# Altium project MCORD_Hub.PrjPcb (part 4 of 4)
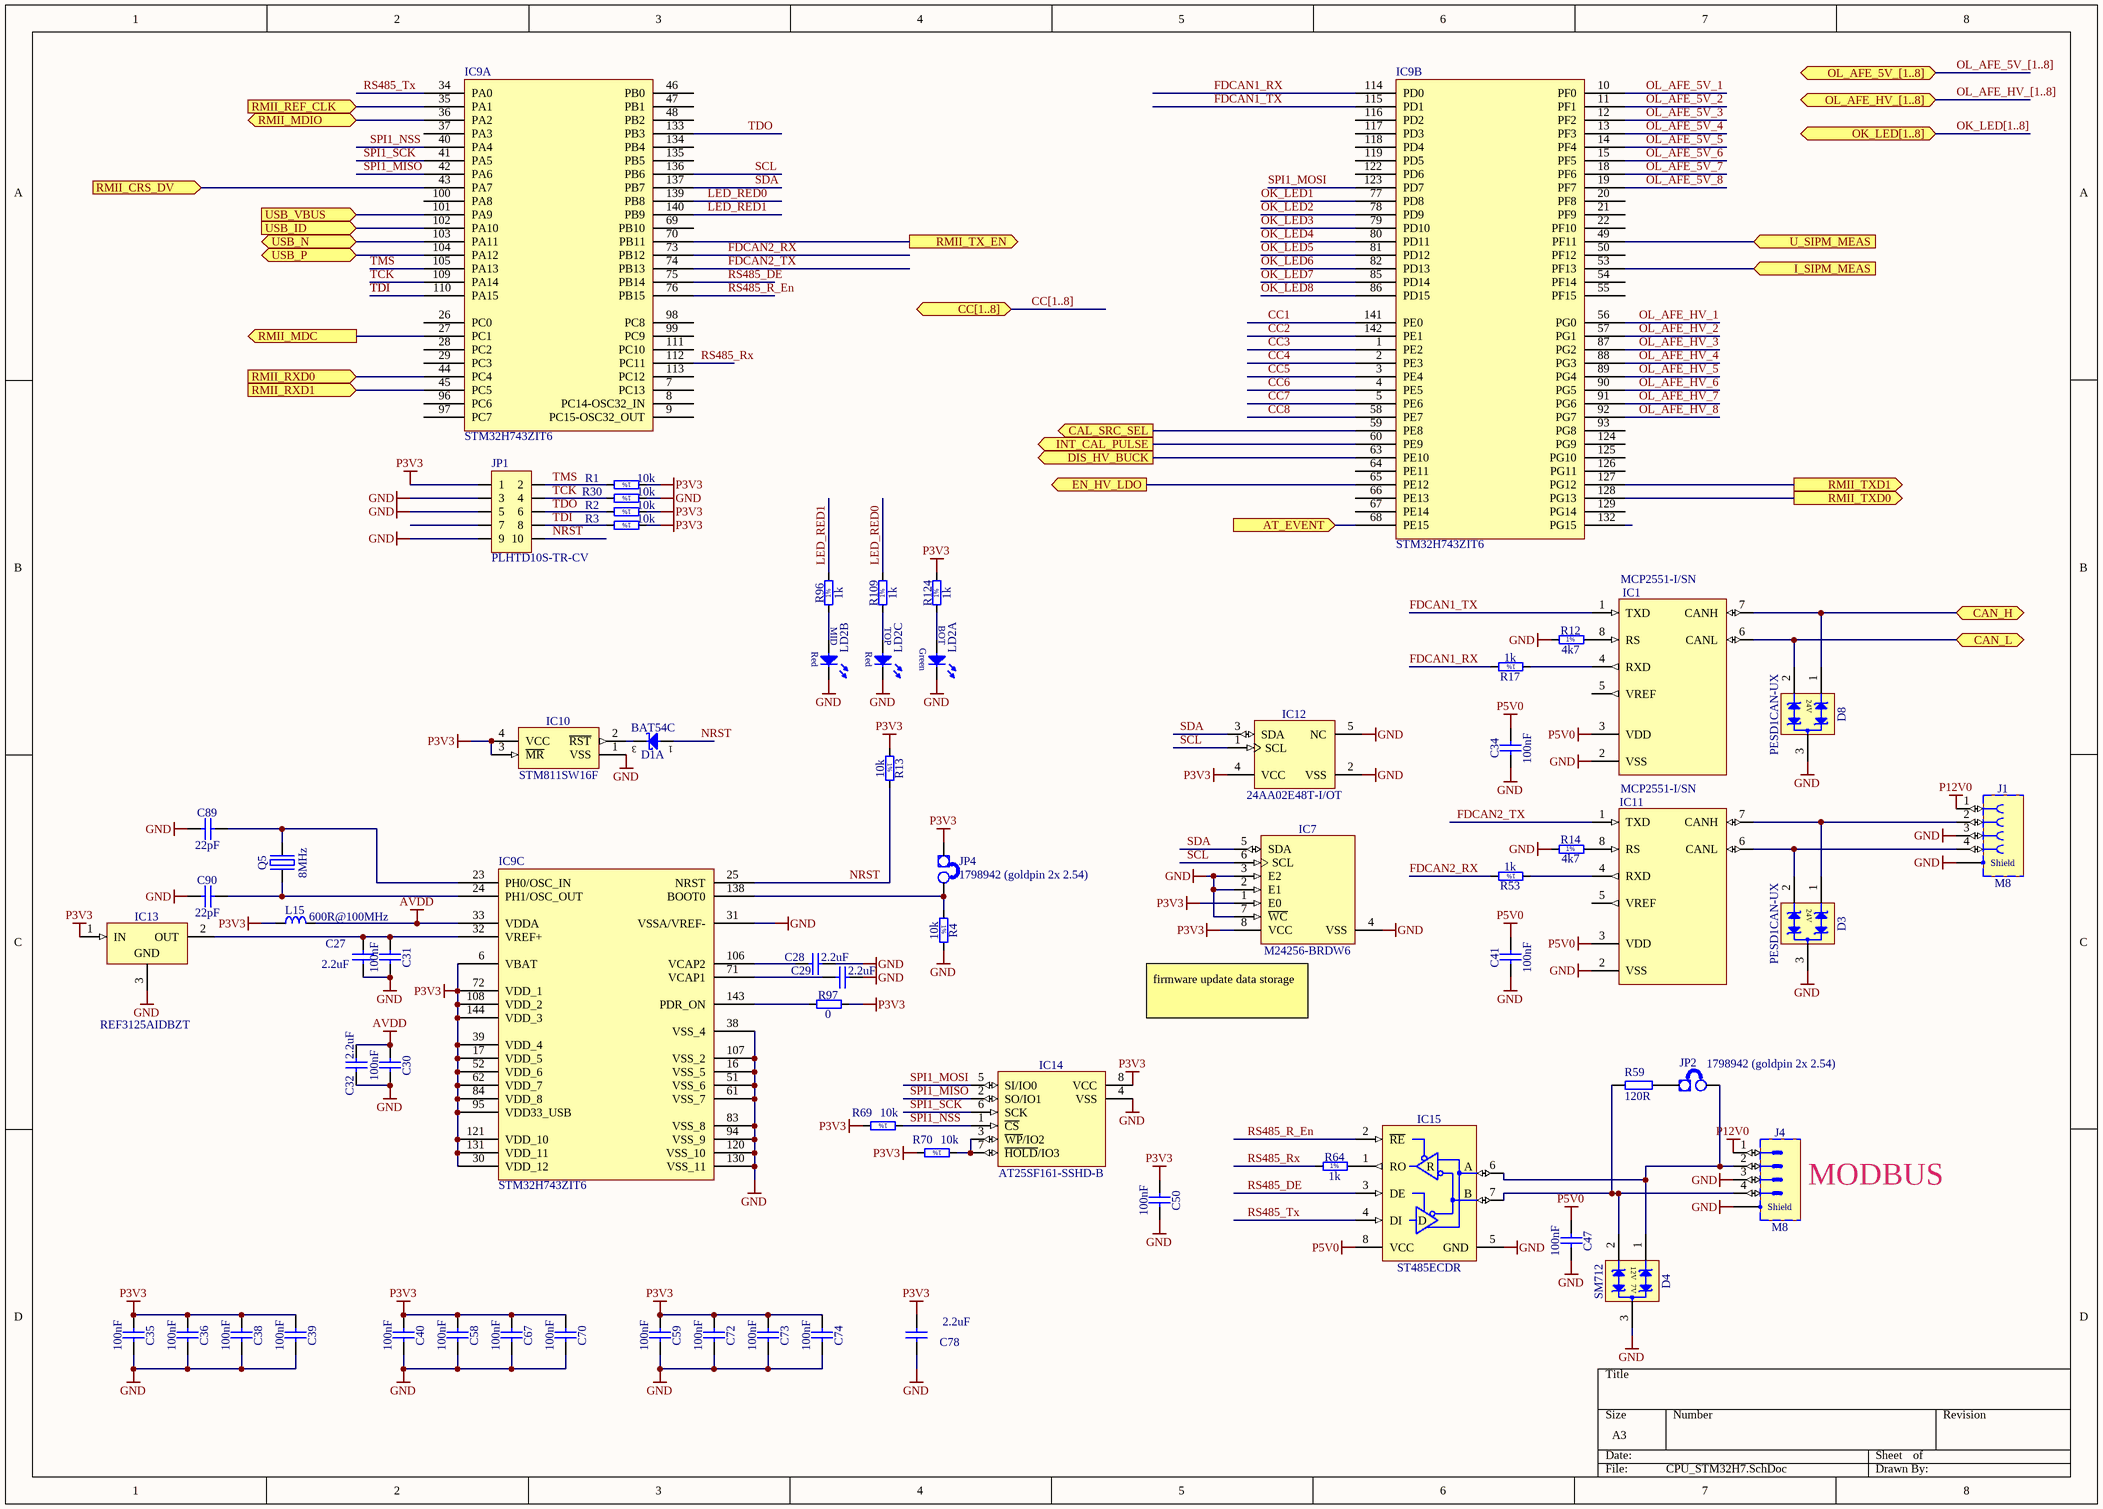
[diagram p7: CPU_STM32H7.SchDoc]

## Nets that join several sheets
GND: MCORD_Hub (53 pins), U_SIPM_ASSY_CON1 (13 pins), U_SIPM_ASSY_CON2 (13 pins), U_SIPM_ASSY_CON3 (13 pins), U_SIPM_ASSY_CON4 (13 pins), U_SIPM_ASSY_CON5 (13 pins), U_SIPM_ASSY_CON6 (13 pins), U_SIPM_ASSY_CON7 (13 pins), U_SIPM_ASSY_CON8 (13 pins), Boost_CNV (28 pins), RMII_Ethernet (21 pins), USB (6 pins), PoE (23 pins), CPU_STM32H7 (64 pins)
P3V3: MCORD_Hub (11 pins), U_SIPM_ASSY_CON1 (R78A.1), U_SIPM_ASSY_CON2 (R78B.1), U_SIPM_ASSY_CON3 (R78C.1), U_SIPM_ASSY_CON4 (R78D.1), U_SIPM_ASSY_CON5 (R78E.1), U_SIPM_ASSY_CON6 (R78F.1), U_SIPM_ASSY_CON7 (R78G.1), U_SIPM_ASSY_CON8 (R78H.1), RMII_Ethernet (8 pins), PoE (6 pins), CPU_STM32H7 (45 pins)
P5V0: U_SIPM_ASSY_CON1 (F2A.1 T1A.2), U_SIPM_ASSY_CON2 (F2B.1 T1B.2), U_SIPM_ASSY_CON3 (F2C.1 T1C.2), U_SIPM_ASSY_CON4 (F2D.1 T1D.2), U_SIPM_ASSY_CON5 (F2E.1 T1E.2), U_SIPM_ASSY_CON6 (F2F.1 T1F.2), U_SIPM_ASSY_CON7 (F2G.1 T1G.2), U_SIPM_ASSY_CON8 (F2H.1 T1H.2), PoE (9 pins), CPU_STM32H7 (6 pins)
P12V0: Boost_CNV (C117.2 IC18.10 L2.1 R6.2), PoE (7 pins), CPU_STM32H7 (J1.1 J4.1)
P70V0: U_SIPM_ASSY_CON1 (R80A.1 T2A.2), U_SIPM_ASSY_CON2 (R80B.1 T2B.2), U_SIPM_ASSY_CON3 (R80C.1 T2C.2), U_SIPM_ASSY_CON4 (R80D.1 T2D.2), U_SIPM_ASSY_CON5 (R80E.1 T2E.2), U_SIPM_ASSY_CON6 (R80F.1 T2F.2), U_SIPM_ASSY_CON7 (R80G.1 T2G.2), U_SIPM_ASSY_CON8 (R80H.1 T2H.2), Boost_CNV (R5.1 U2.4)
CAL0_N: MCORD_Hub (IC16.21 R35.1), U_SIPM_ASSY_CON4 (J12D.A10)
CAL0_N: MCORD_Hub (IC16.23 R32.1), U_SIPM_ASSY_CON3 (J12C.A10)
CAL0_N: MCORD_Hub (IC16.27 R61.1), U_SIPM_ASSY_CON2 (J12B.A10)
CAL0_N: MCORD_Hub (IC16.29 R60.1), U_SIPM_ASSY_CON1 (J12A.A10)
CAL0_N: MCORD_Hub (IC16.19 R37.1), U_SIPM_ASSY_CON5 (J12E.A10)
CAL0_N: MCORD_Hub (IC16.17 R39.1), U_SIPM_ASSY_CON6 (J12F.A10)
CAL0_N: MCORD_Hub (IC16.13 R41.1), U_SIPM_ASSY_CON7 (J12G.A10)
CAL0_N: MCORD_Hub (IC16.11 R43.1), U_SIPM_ASSY_CON8 (J12H.A10)
CAL0_P: MCORD_Hub (IC16.22 R33.1), U_SIPM_ASSY_CON4 (J12D.A11)
CAL0_P: MCORD_Hub (IC16.24 R65.1), U_SIPM_ASSY_CON3 (J12C.A11)
CAL0_P: MCORD_Hub (IC16.28 R25.1), U_SIPM_ASSY_CON2 (J12B.A11)
CAL0_P: MCORD_Hub (IC16.30 R55.1), U_SIPM_ASSY_CON1 (J12A.A11)
CAL0_P: MCORD_Hub (IC16.20 R36.1), U_SIPM_ASSY_CON5 (J12E.A11)
CAL0_P: MCORD_Hub (IC16.18 R38.1), U_SIPM_ASSY_CON6 (J12F.A11)
CAL0_P: MCORD_Hub (IC16.14 R40.1), U_SIPM_ASSY_CON7 (J12G.A11)
CAL0_P: MCORD_Hub (IC16.12 R42.1), U_SIPM_ASSY_CON8 (J12H.A11)
CAN_H: U_SIPM_ASSY_CON1 (J12A.B11), U_SIPM_ASSY_CON2 (J12B.B11), U_SIPM_ASSY_CON3 (J12C.B11), U_SIPM_ASSY_CON4 (J12D.B11), U_SIPM_ASSY_CON5 (J12E.B11), U_SIPM_ASSY_CON6 (J12F.B11), U_SIPM_ASSY_CON7 (J12G.B11), U_SIPM_ASSY_CON8 (J12H.B11)
CAN_L: U_SIPM_ASSY_CON1 (J12A.B10), U_SIPM_ASSY_CON2 (J12B.B10), U_SIPM_ASSY_CON3 (J12C.B10), U_SIPM_ASSY_CON4 (J12D.B10), U_SIPM_ASSY_CON5 (J12E.B10), U_SIPM_ASSY_CON6 (J12F.B10), U_SIPM_ASSY_CON7 (J12G.B10), U_SIPM_ASSY_CON8 (J12H.B10)
DET_OUT0_N: MCORD_Hub (J6.B3), U_SIPM_ASSY_CON1 (J12A.A3)
DET_OUT0_N: MCORD_Hub (J6.B6), U_SIPM_ASSY_CON2 (J12B.A3)
DET_OUT0_N: MCORD_Hub (J6.B9), U_SIPM_ASSY_CON3 (J12C.A3)
DET_OUT0_N: MCORD_Hub (J6.B12), U_SIPM_ASSY_CON4 (J12D.A3)
DET_OUT0_N: MCORD_Hub (J7.B3), U_SIPM_ASSY_CON5 (J12E.A3)
DET_OUT0_N: MCORD_Hub (J7.B6), U_SIPM_ASSY_CON6 (J12F.A3)
DET_OUT0_N: MCORD_Hub (J7.B9), U_SIPM_ASSY_CON7 (J12G.A3)
DET_OUT0_N: MCORD_Hub (J7.B12), U_SIPM_ASSY_CON8 (J12H.A3)
DET_OUT0_P: MCORD_Hub (J6.B2), U_SIPM_ASSY_CON1 (J12A.A2)
DET_OUT0_P: MCORD_Hub (J6.B5), U_SIPM_ASSY_CON2 (J12B.A2)
DET_OUT0_P: MCORD_Hub (J6.B8), U_SIPM_ASSY_CON3 (J12C.A2)
DET_OUT0_P: MCORD_Hub (J6.B11), U_SIPM_ASSY_CON4 (J12D.A2)
DET_OUT0_P: MCORD_Hub (J7.B2), U_SIPM_ASSY_CON5 (J12E.A2)
DET_OUT0_P: MCORD_Hub (J7.B5), U_SIPM_ASSY_CON6 (J12F.A2)
DET_OUT0_P: MCORD_Hub (J7.B8), U_SIPM_ASSY_CON7 (J12G.A2)
DET_OUT0_P: MCORD_Hub (J7.B11), U_SIPM_ASSY_CON8 (J12H.A2)
DET_OUT1_N: MCORD_Hub (J6.A3), U_SIPM_ASSY_CON1 (J12A.B3)
DET_OUT1_N: MCORD_Hub (J6.A6), U_SIPM_ASSY_CON2 (J12B.B3)
DET_OUT1_N: MCORD_Hub (J6.A9), U_SIPM_ASSY_CON3 (J12C.B3)
DET_OUT1_N: MCORD_Hub (J6.A12), U_SIPM_ASSY_CON4 (J12D.B3)
DET_OUT1_N: MCORD_Hub (J7.A3), U_SIPM_ASSY_CON5 (J12E.B3)
DET_OUT1_N: MCORD_Hub (J7.A6), U_SIPM_ASSY_CON6 (J12F.B3)
DET_OUT1_N: MCORD_Hub (J7.A9), U_SIPM_ASSY_CON7 (J12G.B3)
DET_OUT1_N: MCORD_Hub (J7.A12), U_SIPM_ASSY_CON8 (J12H.B3)
DET_OUT1_P: MCORD_Hub (J6.A2), U_SIPM_ASSY_CON1 (J12A.B2)
DET_OUT1_P: MCORD_Hub (J6.A5), U_SIPM_ASSY_CON2 (J12B.B2)
DET_OUT1_P: MCORD_Hub (J6.A8), U_SIPM_ASSY_CON3 (J12C.B2)
DET_OUT1_P: MCORD_Hub (J6.A11), U_SIPM_ASSY_CON4 (J12D.B2)
DET_OUT1_P: MCORD_Hub (J7.A2), U_SIPM_ASSY_CON5 (J12E.B2)
DET_OUT1_P: MCORD_Hub (J7.A5), U_SIPM_ASSY_CON6 (J12F.B2)
DET_OUT1_P: MCORD_Hub (J7.A8), U_SIPM_ASSY_CON7 (J12G.B2)
DET_OUT1_P: MCORD_Hub (J7.A11), U_SIPM_ASSY_CON8 (J12H.B2)
POES_IN1: RMII_Ethernet (J24.7), PoE (D13.2 D93.1)
POES_IN2: RMII_Ethernet (J24.2), PoE (D92.2 D96.1)
POES_IN3: RMII_Ethernet (J24.6), PoE (D14.2 D94.1)
POES_IN4: RMII_Ethernet (J24.1), PoE (D15.2 D95.1)